# EAGLE design IRIS_Arduino_Shield_2 (EAGLE 9.5.0)
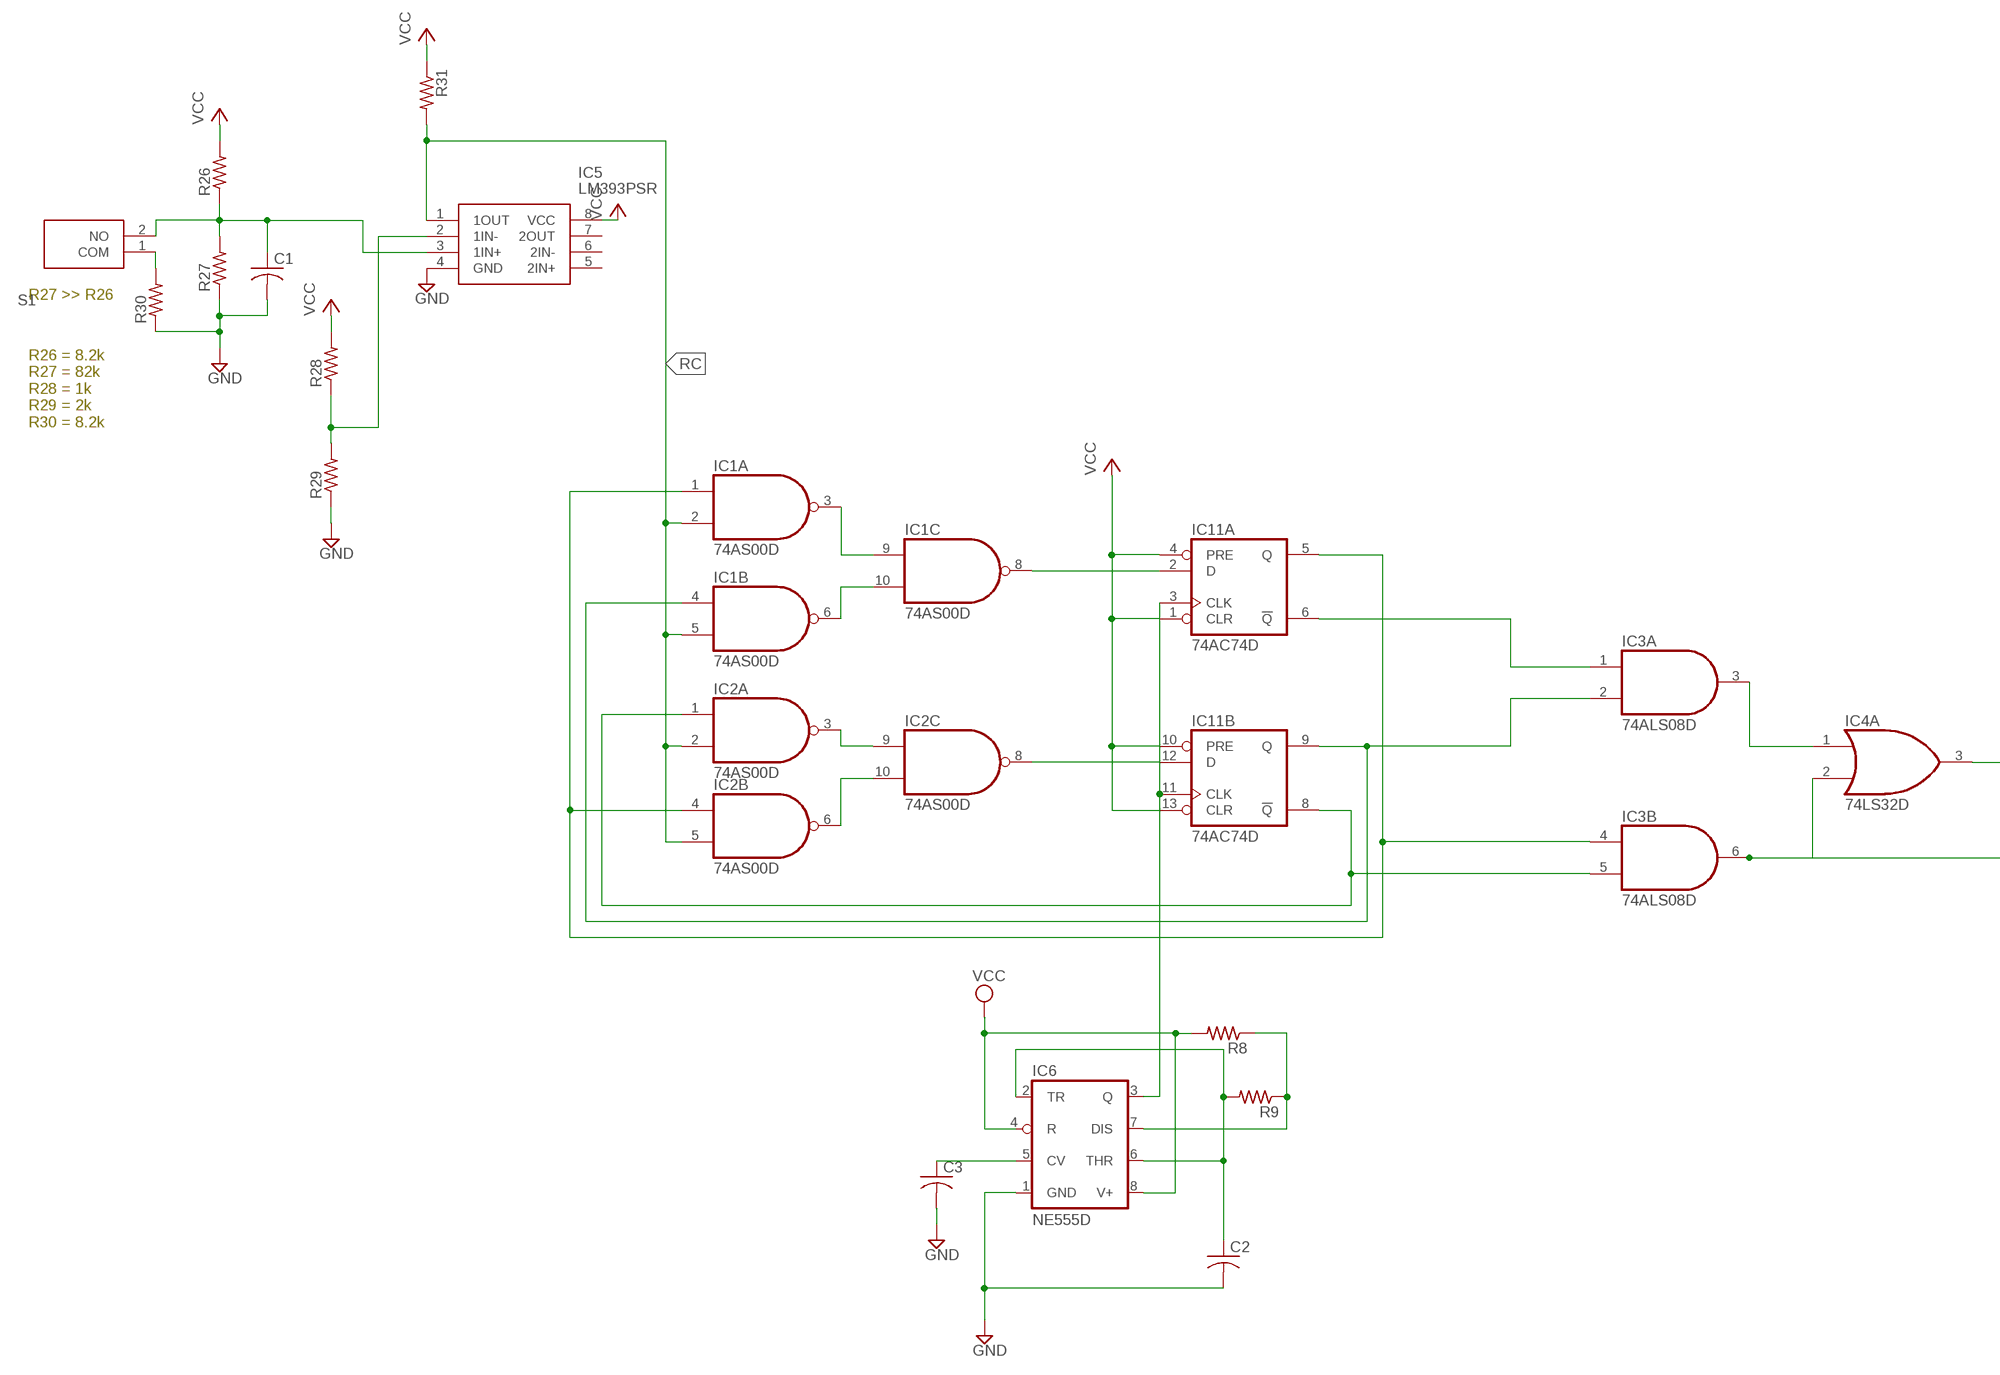
[diagram p0: schematic, sheet 1, part 1 of 2]
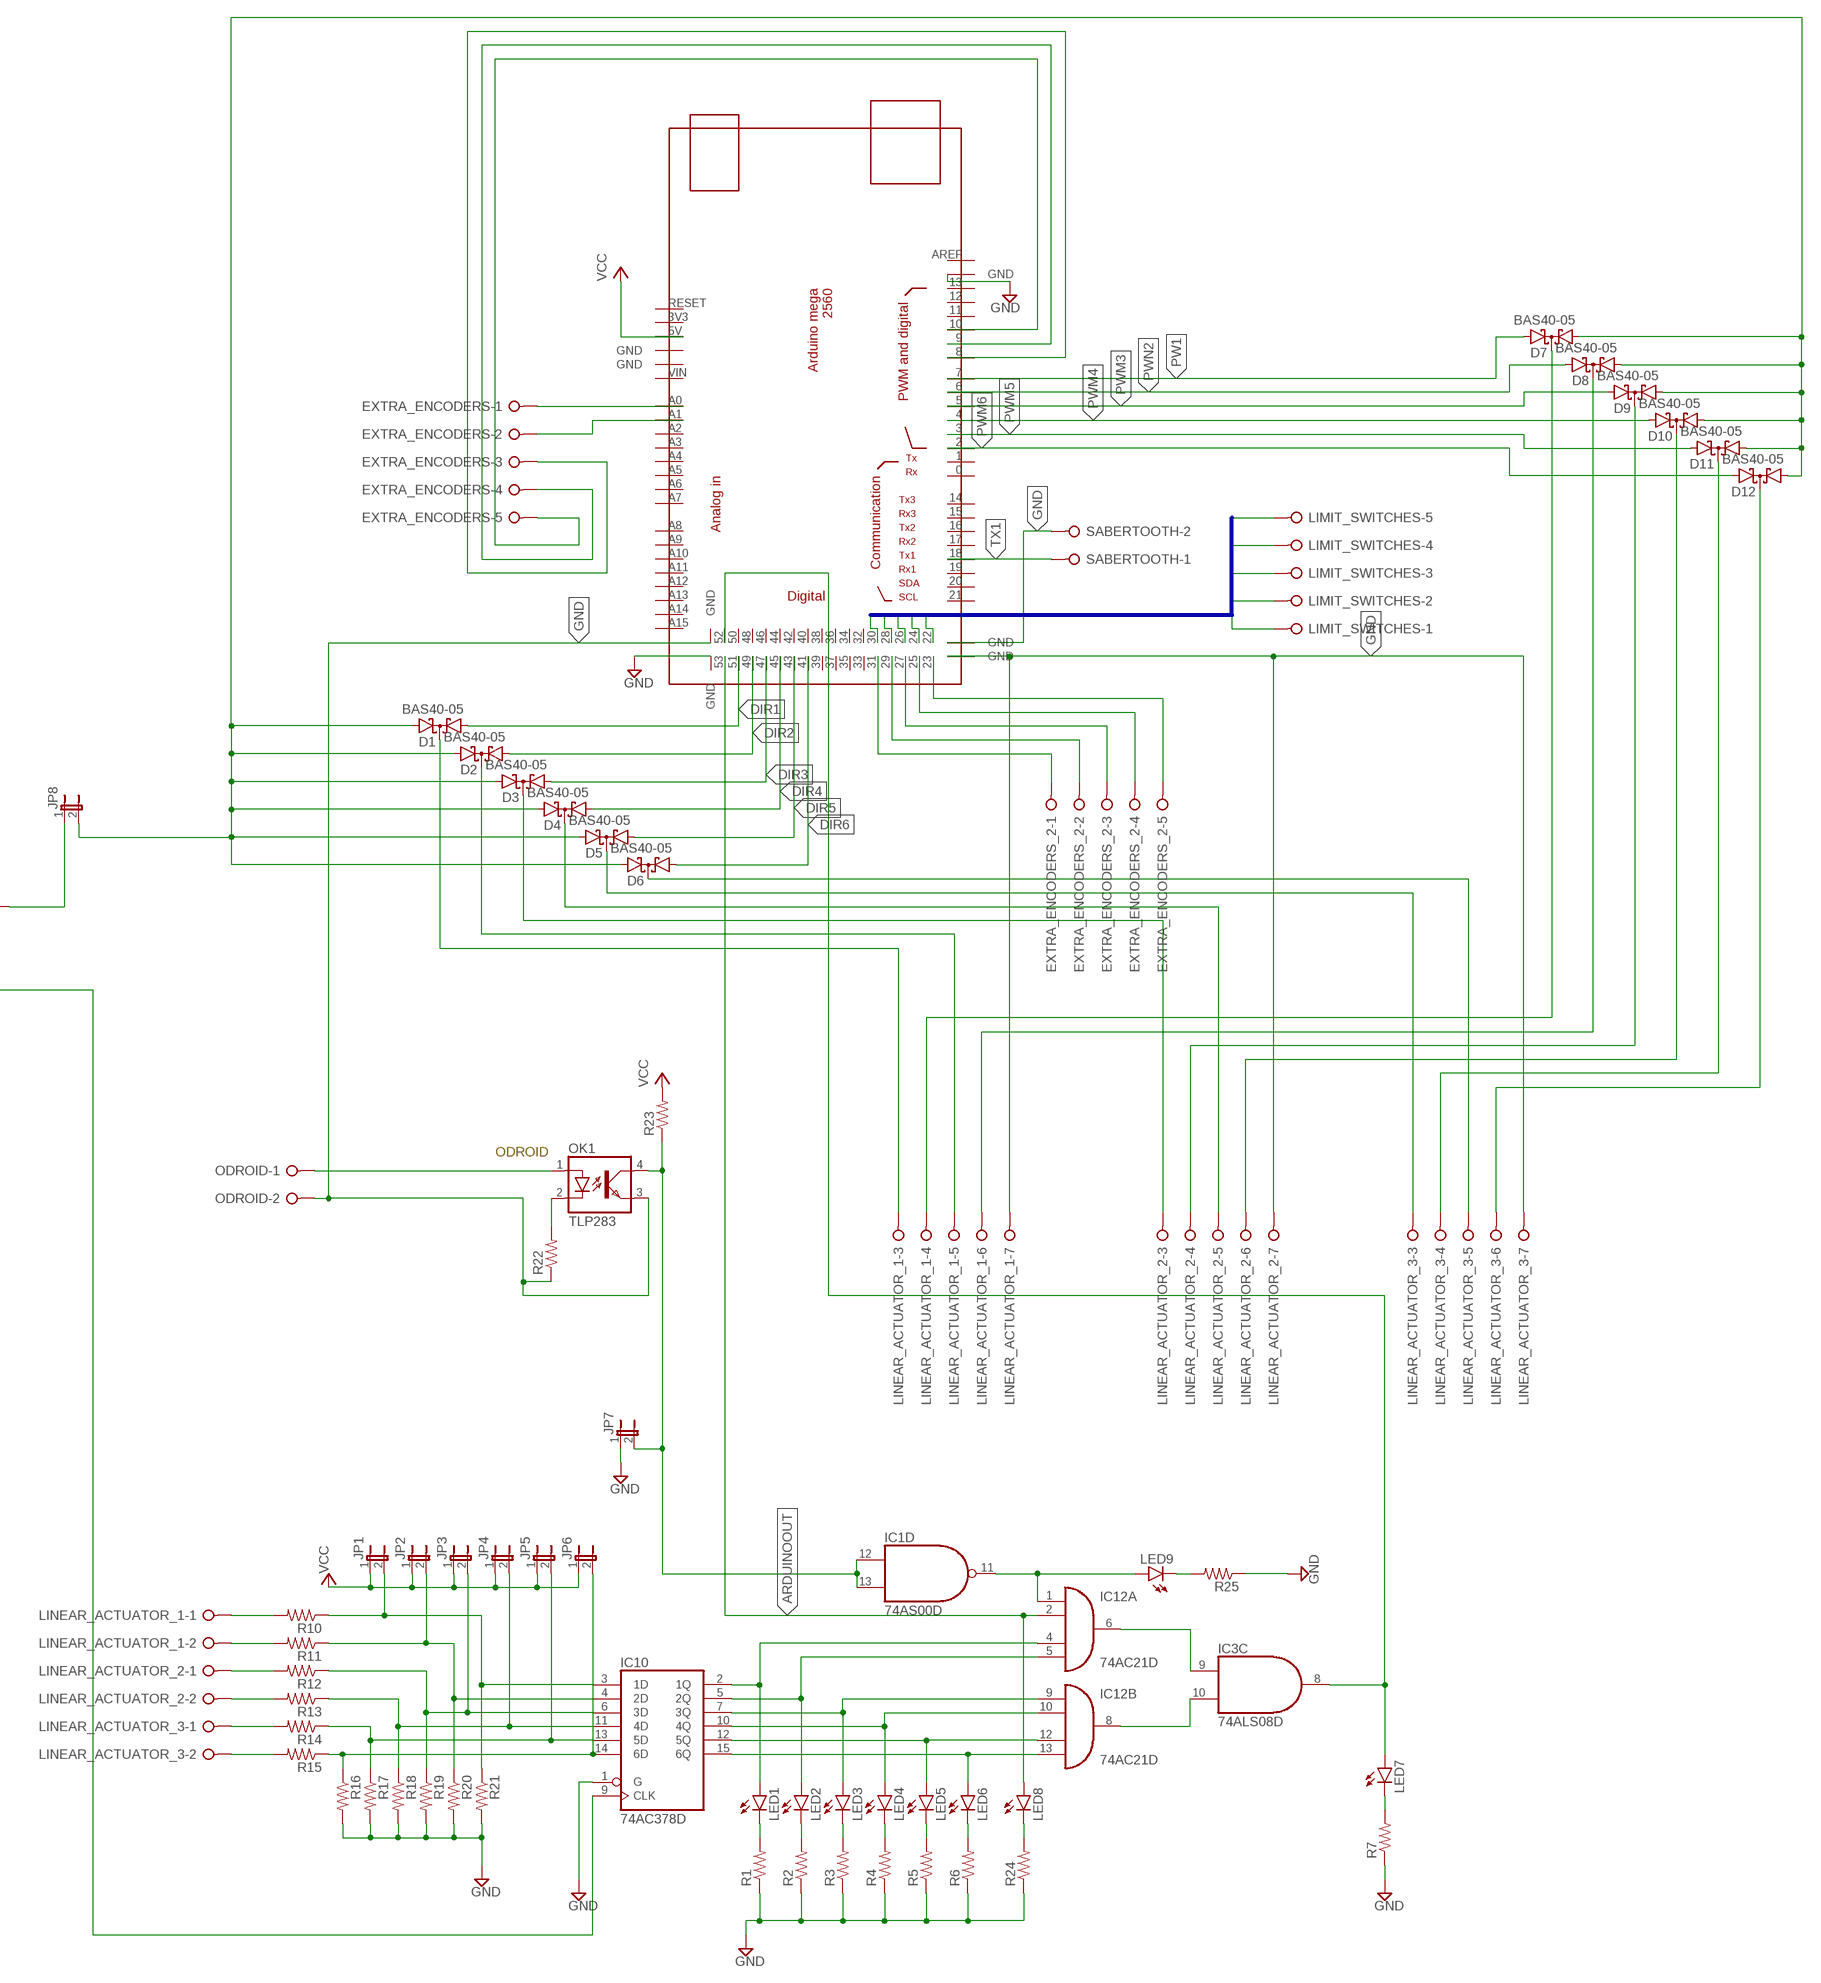
[diagram p1: schematic, sheet 1, part 2 of 2]

## Parts
C1  C-USC0805  [C0805]
C2  C-USC0805  [C0805]
C3  C-USC0805  [C0805]
D1  BAS40-05  [SOT23]
D2  BAS40-05  [SOT23]
D3  BAS40-05  [SOT23]
D4  BAS40-05  [SOT23]
D5  BAS40-05  [SOT23]
D6  BAS40-05  [SOT23]
D7  BAS40-05  [SOT23]
D8  BAS40-05  [SOT23]
D9  BAS40-05  [SOT23]
D10  BAS40-05  [SOT23]
D11  BAS40-05  [SOT23]
D12  BAS40-05  [SOT23]
EXTRA_ENCODERS  W237-05P  [W237-5P]
EXTRA_ENCODERS_2  W237-05P  [W237-5P]
IC1  74AS00D  [SO14]
IC2  74AS00D  [SO14]
IC3  74ALS08D  [SO14]
IC4  74LS32D  [SO14]
IC5  LM393PSR  [SOIC127P780X200-8N]
IC6  NE555D  [SO08]
IC10  74AC378D  [SO16]
IC11  74AC74D  [SO14]
IC12  74AC21D  [SO14]
JP1  JP1E  [JP1]
JP2  JP1E  [JP1]
JP3  JP1E  [JP1]
JP4  JP1E  [JP1]
JP5  JP1E  [JP1]
JP6  JP1E  [JP1]
JP7  JP1E  [JP1]
JP8  JP1E  [JP1]
LED1  LEDCHIPLED_1206  [CHIPLED_1206]
LED2  LEDCHIPLED_1206  [CHIPLED_1206]
LED3  LEDCHIPLED_1206  [CHIPLED_1206]
LED4  LEDCHIPLED_1206  [CHIPLED_1206]
LED5  LEDCHIPLED_1206  [CHIPLED_1206]
LED6  LEDCHIPLED_1206  [CHIPLED_1206]
LED7  LEDCHIPLED_1206  [CHIPLED_1206]
LED8  LEDCHIPLED_1206  [CHIPLED_1206]
LED9  LEDCHIPLED_1206  [CHIPLED_1206]
LIMIT_SWITCHES  W237-05P  [W237-5P]
LINEAR_ACTUATOR_1  W237-07P  [W237-7P]
LINEAR_ACTUATOR_2  W237-07P  [W237-7P]
LINEAR_ACTUATOR_3  W237-07P  [W237-7P]
ODROID  W237-02P  [W237-132]
OK1  TLP283  [MINI-FLAT-4]
R1  R-US_R0805  [R0805]
R2  R-US_R0805  [R0805]
R3  R-US_R0805  [R0805]
R4  R-US_R0805  [R0805]
R5  R-US_R0805  [R0805]
R6  R-US_R0805  [R0805]
R7  R-US_R0805  [R0805]
R8  R-US_R0805  [R0805]
R9  R-US_R0805  [R0805]
R10  R-US_R0805  [R0805]
R11  R-US_R0805  [R0805]
R12  R-US_R0805  [R0805]
R13  R-US_R0805  [R0805]
R14  R-US_R0805  [R0805]
R15  R-US_R0805  [R0805]
R16  R-US_R0805  [R0805]
R17  R-US_R0805  [R0805]
R18  R-US_R0805  [R0805]
R19  R-US_R0805  [R0805]
R20  R-US_R0805  [R0805]
R21  R-US_R0805  [R0805]
R22  R-US_R0805  [R0805]
R23  R-US_R0805  [R0805]
R24  R-US_R0805  [R0805]
R25  R-US_R0805  [R0805]
R26  R-US_R0805  [R0805]
R27  R-US_R0805  [R0805]
R28  R-US_R0805  [R0805]
R29  R-US_R0805  [R0805]
R30  R-US_R0805  [R0805]
R31  R-US_R0805  [R0805]
S1  PTS636_SL43_SMTR_LFS  [PTS636SL43SMTRLFS]
SABERTOOTH  W237-02P  [W237-132]
U$1  MEGA_DEVICE  [MEGAOUTLINE]

## Nets
ARDUINOOUT: IC12.2(A:I1) LED8.A U$1.53
DIR1: D1.1(A1) U$1.51
DIR2: D2.1(A1) U$1.49
DIR3: D3.1(A1) U$1.47
DIR4: D4.1(A1) U$1.45
DIR5: D5.1(A1) U$1.43
DIR6: D6.1(A1) U$1.41
GND: C1.2 C2.2 C3.2 IC5.4(GND) IC6.1(GND) IC10.1(G) JP7.1 LINEAR_ACTUATOR_1.7 LINEAR_ACTUATOR_2.7 LINEAR_ACTUATOR_3.7 ODROID.2 OK1.3(EMIT) R1.1 R2.1 R3.1 R4.1 R5.1 R6.1 R7.1 R16.2 R17.2 R18.2 R19.2 R20.2 R21.2 R22.1 R24.1 R25.1 R27.1 R29.1 R30.1 SABERTOOTH.2 U$1.GND@1(GND) U$1.GND@4(GND) U$1.GND@5(GND) U$1.GND@6(GND) U$1.GND@7(GND)
LA_TEST: D1.2(A2) D2.2(A2) D3.2(A2) D4.2(A2) D5.2(A2) D6.2(A2) D7.1(A1) D8.1(A1) D9.1(A1) D10.1(A1) D11.1(A1) D12.1(A1) JP8.2
N$1: IC1.3(A:O) IC1.9(C:I0)
N$2: IC1.6(B:O) IC1.10(C:I1)
N$3: IC1.8(C:O) IC11.2(A:D)
N$4: D7.3(C) LINEAR_ACTUATOR_1.4
N$5: IC6.3(Q) IC11.3(A:CLK) IC11.11(B:CLK)
N$6: IC2.8(C:O) IC11.12(B:D)
N$7: LED1.C R1.2
N$8: LED2.C R2.2
N$9: LED3.C R3.2
N$10: LED4.C R4.2
N$11: LED5.C R5.2
N$12: LED6.C R6.2
N$13: IC10.2(1Q) IC12.4(A:I2) LED1.A
N$14: IC10.5(2Q) IC12.5(A:I3) LED2.A
N$15: IC10.7(3Q) IC12.9(B:I0) LED3.A
N$16: IC10.10(4Q) IC12.10(B:I1) LED4.A
N$17: IC10.12(5Q) IC12.12(B:I2) LED5.A
N$18: IC10.15(6Q) IC12.13(B:I3) LED6.A
N$19: IC3.9(C:I0) IC12.6(A:O)
N$20: IC3.10(C:I1) IC12.8(B:O)
N$21: IC3.8(C:O) LED7.A U$1.52
N$22: LED7.C R7.2
N$23: IC2.3(A:O) IC2.9(C:I0)
N$24: IC2.6(B:O) IC2.10(C:I1)
N$25: IC4.3(A:O) JP8.1
N$26: C1.1 IC5.3(1IN+) R26.1 R27.2 S1.2(NO)
N$27: IC5.2(1IN-) R28.1 R29.2
N$28: C2.1 IC6.2(TR) IC6.6(THR) R9.2
N$29: D1.3(C) LINEAR_ACTUATOR_1.3
N$30: IC6.7(DIS) R8.1 R9.1
N$31: IC3.1(A:I0) IC11.6(A:!Q)
N$32: IC10.3(1D) JP1.2 R10.1 R21.1
N$33: ODROID.1 OK1.1(A)
N$34: IC10.4(2D) JP2.2 R11.1 R20.1
N$35: IC10.6(3D) JP3.2 R12.1 R19.1
N$36: IC10.11(4D) JP4.2 R13.1 R18.1
N$37: IC10.13(5D) JP5.2 R14.1 R17.1
N$38: IC10.14(6D) JP6.2 R15.1 R16.1
N$39: D8.3(C) LINEAR_ACTUATOR_1.6
N$40: D9.3(C) LINEAR_ACTUATOR_2.4
N$41: IC2.1(A:I0) IC3.5(B:I1) IC11.8(B:!Q)
N$42: IC1.1(A:I0) IC2.4(B:I0) IC3.4(B:I0) IC11.5(A:Q)
N$43: IC1.4(B:I0) IC3.2(A:I1) IC11.9(B:Q)
N$44: D10.3(C) LINEAR_ACTUATOR_2.6
N$45: D11.3(C) LINEAR_ACTUATOR_3.4
N$46: LED8.C R24.2
N$47: OK1.2(C) R22.2
N$48: LED9.C R25.2
N$49: IC1.12(D:I0) IC1.13(D:I1) JP7.2 OK1.4(COL) R23.1
N$50: EXTRA_ENCODERS.1 U$1.A0
N$51: IC1.11(D:O) IC12.1(A:I0) LED9.A
N$52: EXTRA_ENCODERS.2 U$1.A1
N$53: EXTRA_ENCODERS.4 U$1.9
N$54: R30.2 S1.1(COM)
N$55: D2.3(C) LINEAR_ACTUATOR_1.5
N$56: EXTRA_ENCODERS.3 U$1.8
N$57: D3.3(C) LINEAR_ACTUATOR_2.3
N$58: D4.3(C) LINEAR_ACTUATOR_2.5
N$59: D5.3(C) LINEAR_ACTUATOR_3.3
N$60: D6.3(C) LINEAR_ACTUATOR_3.5
N$61: D12.3(C) LINEAR_ACTUATOR_3.6
N$62: IC3.6(B:O) IC4.2(A:I1) IC10.9(CLK)
N$63: LINEAR_ACTUATOR_1.1 R10.2
N$64: LINEAR_ACTUATOR_1.2 R11.2
N$65: LINEAR_ACTUATOR_2.1 R12.2
N$66: LINEAR_ACTUATOR_2.2 R13.2
N$67: LINEAR_ACTUATOR_3.1 R14.2
N$68: LINEAR_ACTUATOR_3.2 R15.2
N$69: C3.1 IC6.5(CV)
N$70: EXTRA_ENCODERS.5 U$1.10
N$71: IC3.3(A:O) IC4.1(A:I0)
N$72: EXTRA_ENCODERS_2.5 U$1.23
N$73: EXTRA_ENCODERS_2.4 U$1.25
N$74: EXTRA_ENCODERS_2.3 U$1.27
N$75: EXTRA_ENCODERS_2.2 U$1.29
N$76: EXTRA_ENCODERS_2.1 U$1.31
N$77: LIMIT_SWITCHES.1 U$1.30
N$78: LIMIT_SWITCHES.2 U$1.28
N$79: LIMIT_SWITCHES.3 U$1.26
N$80: LIMIT_SWITCHES.4 U$1.24
N$81: LIMIT_SWITCHES.5 U$1.22
PW1: D7.2(A2) U$1.7
PWM3: D9.2(A2) U$1.5
PWM4: D10.2(A2) U$1.4
PWM5: D11.2(A2) U$1.3
PWM6: D12.2(A2) U$1.2
PWN2: D8.2(A2) U$1.6
RC: IC1.2(A:I1) IC1.5(B:I1) IC2.2(A:I1) IC2.5(B:I1) IC5.1(1OUT) R31.2
TX1: SABERTOOTH.1 U$1.18
VCC: IC5.8(VCC) IC6.4(R) IC6.8(V+) IC11.1(A:CLR) IC11.4(A:PRE) IC11.10(B:PRE) IC11.13(B:CLR) JP1.1 JP2.1 JP3.1 JP4.1 JP5.1 JP6.1 R8.2 R23.2 R26.2 R28.2 R31.1 U$1.5V
Unconnected: IC2.11(D:O) IC2.12(D:I0) IC2.13(D:I1) IC3.11(D:O) IC3.12(D:I0) IC3.13(D:I1) IC4.4(B:I0) IC4.5(B:I1) IC4.6(B:O) IC4.8(C:O) IC4.9(C:I0) IC4.10(C:I1) IC4.11(D:O) IC4.12(D:I0) IC4.13(D:I1) IC5.5(2IN+) IC5.6(2IN-) IC5.7(2OUT) U$1.0 U$1.1 U$1.3V3 U$1.11 U$1.12 U$1.13 U$1.14 U$1.15 U$1.16 U$1.17 U$1.19 U$1.20 U$1.21 U$1.32 U$1.33 U$1.34 U$1.35 U$1.36 U$1.37 U$1.38 U$1.39 U$1.40 U$1.42 U$1.44 U$1.46 U$1.48 U$1.50 U$1.A2 U$1.A3 U$1.A4 U$1.A5 U$1.A6 U$1.A7 U$1.A8 U$1.A9 U$1.A10 U$1.A11 U$1.A12 U$1.A13 U$1.A14 U$1.A15 U$1.AREF U$1.GND@2(GND) U$1.GND@3(GND) U$1.RESET U$1.VIN

## Buses
N$77,N$78,N$79,N$80,N$81

## Notes on the sheet
- R27 >> R26
- R26 = 8.2k
  R27 = 82k
  R28 = 1k
  R29 = 2k
  R30 = 8.2k
- ODROID

## Power pins joined to a net without a drawn wire
GND: IC1.7(P:GND) IC2.7(P:GND) IC3.7(P:GND) IC4.7(P:GND) IC10.8(GND) IC11.7(P:GND) IC12.7(P:GND)
VCC: IC1.14(P:VCC) IC2.14(P:VCC) IC3.14(P:VCC) IC4.14(P:VCC) IC10.16(VCC) IC11.14(P:VCC) IC12.14(P:VCC)

## Library data of the parts
C1-C3 = rcl:C-US: CAPACITOR, American symbol; SPICEPREFIX: C
D1-D12 = diode:BAS40-05: Silicon Schottky Diodes General-purpose diode for high-speed switching
EXTRA_ENCODERS EXTRA_ENCODERS_2 LIMIT_SWITCHES = con-wago-508:W237-05P: WAGO SREW CLAMP; OC_FARNELL: unknown; OC_NEWARK: unknown
IC1 IC2 = 74xx-us:74*00: Quad 2-input NAND gate
IC3 = 74xx-us:74*08: Quad 2-input AND gate
IC4 = 74xx-us:74*32: Quad 2-input OR gate
IC5 = SamacSys_Parts:LM393PSR: Dual differential comparator, commercial grade Source: Datasheet <http://www.ti.com/lit/gpn/lm393>; DESCRIPTION: Dual differential comparator, commercial grade; HEIGHT: 2mm; MANUFACTURER_NAME: Texas Instruments; MANUFACTURER_PART_NUMBER: LM393PSR; MOUSER_PART_NUMBER: 595-LM393PSR; MOUSER_PRICE-STOCK: https://www.mouser.com/Search/Refine.aspx?Keyword=595-LM393PSR
IC6 = linear:*555: TIMER
IC10 = 74xx-eu:74*378: Hex D type FLIP FLOP, enable
IC11 = 74xx-eu:74*74: Dual D type positive edge triggered FLIP FLOP, preset and clear
IC12 = 74xx-eu:74*21: Dual 4-input AND gate
JP1-JP8 = jumper:JP1E: JUMPER
LED1-LED9 = led:LED: LED OSRAM: - CHIPLED LG R971, LG N971, LY N971, LG Q971, LY Q971, LO R971, LY R971 LH N974, LH R974 LS Q976, LO Q976, LY Q976 LO Q996 - Hyper CHIPLED LW Q18S LB Q993, LB Q99A, LB R99A - SideLED LS A670, LO A670, LY A670, LG A670, LP A670 LB A673, LV A673, LT A673, LW A673 LH A674 LY A675 LS A676, LA A676, LO A676, LY A676, LW A676 LS A679, LY A679, LG A679 - Hyper Micro SIDELED® LS Y876, LA Y876, LO Y876, LY Y876 LT Y87S - SmartLED LW L88C, LW L88S LB L89C, LB L89S, LG L890 LS L89K, LO L89K, LY L89K LS L896, LA L896, LO L896, LY L896 - TOPLED LS T670, LO T670, LY T670, LG T670, LP T670 LSG T670, LSP T670, LSY T670, LOP T670, LYG T670 LG T671, LOG T671, LSG T671 LB T673, LV T673, LT T673, LW T673 LH T674 LS T676, LA T676, LO T676, LY T676, LB T676, LH T676, LSB T676, LW T676 LB T67C, LV T67C, LT T67C, LS T67K, LO T67K, LY T67K, LW E67C LS E67B, LA E67B, LO E67B, LY E67B, LB E67C, LV E67C, LT E67C LW T67C LS T679, LY T679, LG T679 LS T770, LO T770, LY T770, LG T770, LP T770 LB T773, LV T773, LT T773, LW T773 LH T774 LS E675, LA E675, LY E675, LS T675 LS T776, LA T776, LO T776, LY T776, LB T776 LHGB T686 LT T68C, LB T68C - Hyper Mini TOPLED® LB M676 - Mini TOPLED Santana® LG M470 LS M47K, LO M47K, LY M47K Source: http://www.osram.convergy.de LUXEON: - LUMILED® LXK2-PW12-R00, LXK2-PW12-S00, LXK2-PW14-U00, LXK2-PW14-V00 LXK2-PM12-R00, LXK2-PM12-S00, LXK2-PM14-U00 LXK2-PE12-Q00, LXK2-PE12-R00, LXK2-PE12-S00, LXK2-PE14-T00, LXK2-PE14-U00 LXK2-PB12-K00, LXK2-PB12-L00, LXK2-PB12-M00, LXK2-PB14-N00, LXK2-PB14-P00, LXK2-PB14-Q00 LXK2-PR12-L00, LXK2-PR12-M00, LXK2-PR14-Q00, LXK2-PR14-R00 LXK2-PD12-Q00, LXK2-PD12-R00, LXK2-PD12-S00 LXK2-PH12-R00, LXK2-PH12-S00 LXK2-PL12-P00, LXK2-PL12-Q00, LXK2-PL12-R00 Source: www.luxeon.com KINGBRIGHT: KA-3528ASYC Source: www.kingbright.com
LINEAR_ACTUATOR_1-LINEAR_ACTUATOR_3 = con-wago-508:W237-07P: WAGO SREW CLAMP; OC_FARNELL: unknown; OC_NEWARK: unknown
ODROID SABERTOOTH = con-wago-508:W237-02P: WAGO SREW CLAMP; OC_FARNELL: unknown; OC_NEWARK: unknown
OK1 = optocoupler:TLP283: TOSHIBA PHOTOCOUPLER GaAs IRED & PHOTO-TRANSISTOR Source: http://www.semicon.toshiba.co.jp/td/en/Opto/Photocoupler/en_20050928_TLP283_datasheet.pdf; OC_FARNELL: unknown; OC_NEWARK: unknown
R1-R31 = rcl:R-US_: RESISTOR, American symbol; SPICEPREFIX: R
S1 = SamacSys_Parts:PTS636_SL43_SMTR_LFS: Tactile Switches Tact 50mA 12VDC, 6.0x3.5, 4.3mm H, 130gf, G leads, No ground pin, Black Actuator Source: Datasheet <https://www.mouser.com/datasheet/2/60/pts636-1550567.pdf>; DESCRIPTION: Tactile Switches Tact 50mA 12VDC, 6.0x3.5, 4.3mm H, 130gf, G leads, No ground pin, Black Actuator; HEIGHT: 4.5mm; MANUFACTURER_NAME: C & K COMPONENTS; MANUFACTURER_PART_NUMBER: PTS636 SL43 SMTR LFS; MOUSER_PART_NUMBER: 611-PTS636SL43SMTRLF; MOUSER_PRICE-STOCK: https://www.mouser.com/Search/Refine.aspx?Keyword=611-PTS636SL43SMTRLF
U$1 = ArduinoMegaOutline:MEGA_DEVICE: mega card as device

## Board
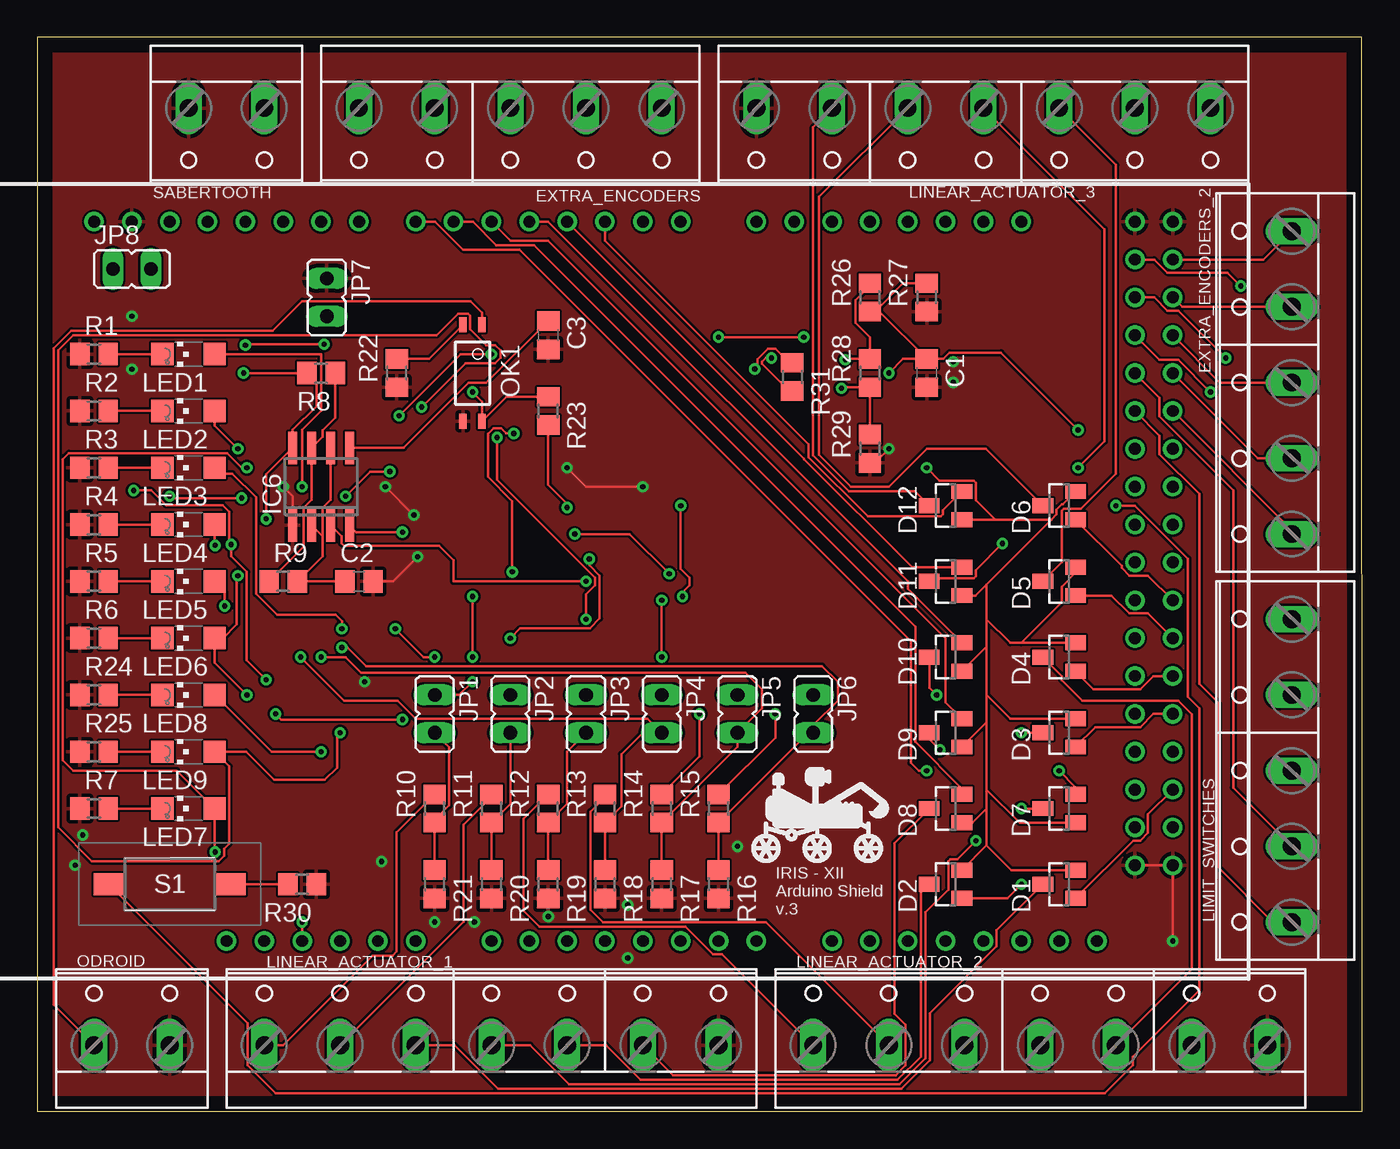
[diagram p2: board, top side]
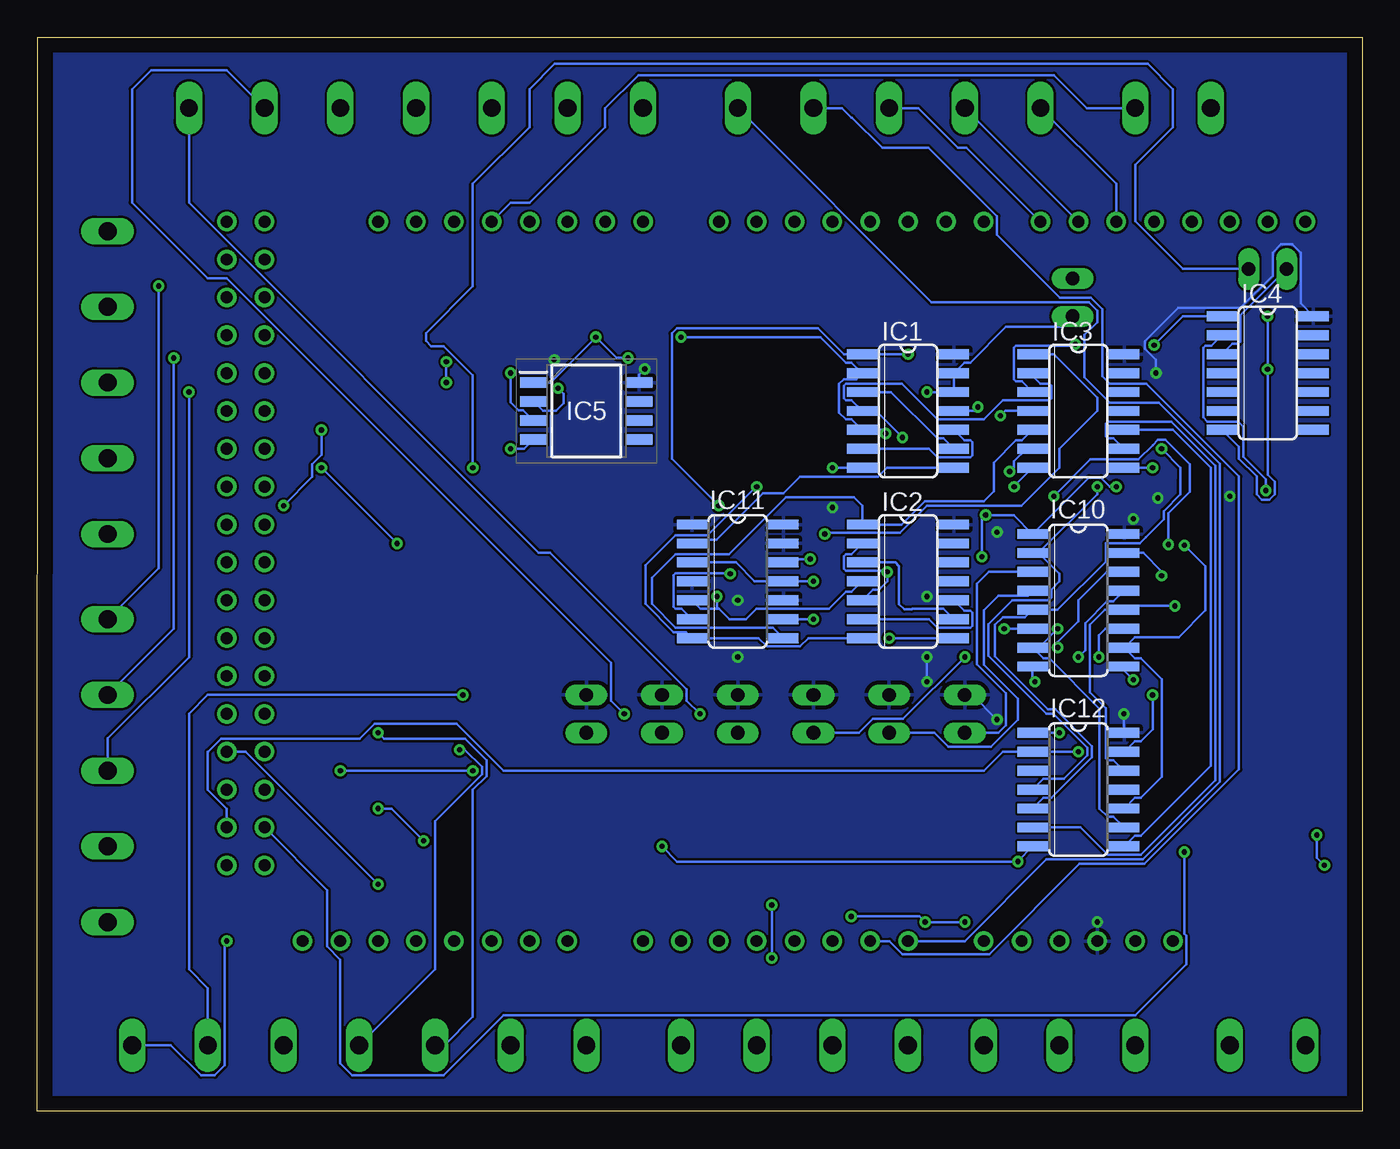
[diagram p3: board, bottom side, seen from below]

Size 88.92 x 72.06 mm. Coordinates in mm from the lower left corner, seen from the top.
Outline: 0,0 88.92,0 88.88,72.06 0,72.06 0,0
Copper layers (1*16): Top 0.035mm / dielectric 1.5mm / Bottom 0.035mm
Design rules "default": minimum track width 6mil, minimum drill 0.35mm, track to track 6mil, track to pad 6mil, pad to pad 6mil, via to via 6mil, smd to smd 6mil, copper to edge 40mil, drill to drill 6mil, minimum pad ring 10mil, minimum via ring 8mil, stop-mask expansion 4mil, vias tented up to drill 0mil, thermal gap 10mil

### Footprints (pad centres in the part's own frame; a part is rotated, then mirrored left to right if it is on the bottom)
C0805 = smd 1.3 x 1.5: 1 -0.95,0; 2 0.95,0
SOT23 = smd 1 x 1.4: 1 -0.95,-1.1; 2 0.95,-1.1; 3 0,1.1
W237-5P = drill 1.194 long: 1 -10.16,-0.635; 2 -5.08,-0.635; 3 0,-0.635; 4 5.08,-0.635; 5 10.16,-0.635
SO14 = smd 0.66 x 2.032: 1 -3.81,-3.073; 2 -2.54,-3.073; 3 -1.27,-3.073; 4 0,-3.073; 5 1.27,-3.073; 6 2.54,-3.073; 7 3.81,-3.073; 8 3.81,3.073; 9 2.54,3.073; 10 1.27,3.073; 11 0,3.073; 12 -1.27,3.073; 13 -2.54,3.073; 14 -3.81,3.073
SOIC127P780X200-8N = smd 1.8 x 0.7: 1 -3.55,1.905; 2 -3.55,0.635; 3 -3.55,-0.635; 4 -3.55,-1.905; 5 3.55,-1.905; 6 3.55,-0.635; 7 3.55,0.635; 8 3.55,1.905
SO08 = smd 0.6 x 2.2: 1 -1.905,-2.6; 2 -0.635,-2.6; 3 0.635,-2.6; 4 1.905,-2.6; 5 1.905,2.6; 6 0.635,2.6; 7 -0.635,2.6; 8 -1.905,2.6
SO16 = smd 0.66 x 2.032: 1 -4.445,-3.073; 2 -3.175,-3.073; 3 -1.905,-3.073; 4 -0.635,-3.073; 5 0.635,-3.073; 6 1.905,-3.073; 7 3.175,-3.073; 8 4.445,-3.073; 9 4.445,3.073; 10 3.175,3.073; 11 1.905,3.073; 12 0.635,3.073; 13 -0.635,3.073; 14 -1.905,3.073; 15 -3.175,3.073; 16 -4.445,3.073
JP1 = drill 0.914 long: 1 0,-1.27; 2 0,1.27
CHIPLED_1206 = smd 1.5 x 1.5: A 0,-1.75; C 0,1.75
W237-7P = drill 1.194 long: 1 -15.24,-0.635; 2 -10.16,-0.635; 3 -5.08,-0.635; 4 0,-0.635; 5 5.08,-0.635; 6 10.16,-0.635; 7 15.24,-0.635
W237-132 = drill 1.194 long: 1 -2.54,-0.635; 2 2.54,-0.635
MINI-FLAT-4 = smd 1 x 0.5: 1 -3.24,0.635; 2 -3.24,-0.635; 3 3.24,-0.635; 4 3.24,0.635
R0805 = smd 1.3 x 1.5: 1 -0.95,0; 2 0.95,0
PTS636SL43SMTRLFS = smd 2 x 1.5: 1 -4.1,0; 2 4.1,0
MEGAOUTLINE = drill 0.8: 0 12.7,24.13; 1 10.16,24.13; 2 7.62,24.13; 3 5.08,24.13; 3V3 -15.24,-24.13; 4 2.54,24.13; 5 0,24.13; 5V -12.7,-24.13; 6 -2.54,24.13; 7 -5.08,24.13; 8 -8.89,24.13; 9 -11.43,24.13; 10 -13.97,24.13; 11 -16.51,24.13; 12 -19.05,24.13; 13 -21.59,24.13; 14 17.78,24.13; 15 20.32,24.13; 16 22.86,24.13; 17 25.4,24.13; 18 27.94,24.13; 19 30.48,24.13; 20 33.02,24.13; 21 35.56,24.13; 22 43.18,21.59; 23 45.72,21.59; 24 43.18,19.05; 25 45.72,19.05; 26 43.18,16.51; 27 45.72,16.51; 28 43.18,13.97; 29 45.72,13.97; 30 43.18,11.43; 31 45.72,11.43; 32 43.18,8.89; 33 45.72,8.89; 34 43.18,6.35; 35 45.72,6.35; 36 43.18,3.81; 37 45.72,3.81; 38 43.18,1.27; 39 45.72,1.27; 40 43.18,-1.27; 41 45.72,-1.27; 42 43.18,-3.81; 43 45.72,-3.81; 44 43.18,-6.35; 45 45.72,-6.35; 46 43.18,-8.89; 47 45.72,-8.89; 48 43.18,-11.43; 49 45.72,-11.43; 50 43.18,-13.97; 51 45.72,-13.97; 52 43.18,-16.51; 53 45.72,-16.51; A0 0,-24.13; A1 2.54,-24.13; A2 5.08,-24.13; A3 7.62,-24.13; A4 10.16,-24.13; A5 12.7,-24.13; A6 15.24,-24.13; A7 17.78,-24.13; A8 22.86,-24.13; A9 25.4,-24.13; A10 27.94,-24.13; A11 30.48,-24.13; A12 33.02,-24.13; A13 35.56,-24.13; A14 38.1,-24.13; A15 40.64,-24.13; AREF -26.67,24.13; GND@1 -24.13,24.13; GND@2 -10.16,-24.13; GND@3 -7.62,-24.13; GND@4 43.18,24.13; GND@5 45.72,24.13; GND@6 43.18,-19.05; GND@7 45.72,-19.05; RESET -17.78,-24.13; VIN -5.08,-24.13

### Placement (x,y rotation side)
C1  59.69,49.53 270 top
C2  21.59,35.56 0 top
C3  34.29,52.07 270 top
D1  68.58,15.24 90 top
D2  60.96,15.24 90 top
D3  68.58,25.4 90 top
D4  68.58,30.48 90 top
D5  68.58,35.56 90 top
D6  68.58,40.64 90 top
D7  68.58,20.32 90 top
D8  60.96,20.32 90 top
D9  60.96,25.4 90 top
D10  60.96,30.48 90 top
D11  60.96,35.56 90 top
D12  60.96,40.64 90 top
EXTRA_ENCODERS  31.75,66.67 180 top
EXTRA_ENCODERS_2  83.57,48.89 90 top
IC1  30.48,46.99 270 bottom
IC2  30.48,35.56 270 bottom
IC3  19.05,46.99 270 bottom
IC4  6.35,49.53 270 bottom
IC5  52.07,46.99 0 bottom
IC6  19.05,41.91 0 top
IC10  19.05,34.29 270 bottom
IC11  41.91,35.56 270 bottom
IC12  19.05,21.59 270 bottom
JP1  26.67,26.67 180 top
JP2  31.75,26.67 180 top
JP3  36.83,26.67 180 top
JP4  41.91,26.67 180 top
JP5  46.99,26.67 180 top
JP6  52.07,26.67 180 top
JP7  19.43,54.61 180 top
JP8  6.35,56.52 270 top
LED1  10.16,50.8 90 top
LED2  10.16,46.99 90 top
LED3  10.16,43.18 90 top
LED4  10.16,39.37 90 top
LED5  10.16,35.56 90 top
LED6  10.16,31.75 90 top
LED7  10.16,20.32 90 top
LED8  10.16,27.94 90 top
LED9  10.16,24.13 90 top
LIMIT_SWITCHES  83.57,22.86 90 top
LINEAR_ACTUATOR_1  30.48,5.08 0 top
LINEAR_ACTUATOR_2  67.31,5.08 0 top
LINEAR_ACTUATOR_3  63.5,66.67 180 top
ODROID  6.35,5.08 0 top
OK1  29.21,49.53 270 top
R1  3.81,50.8 0 top
R2  3.81,46.99 0 top
R3  3.81,43.18 0 top
R4  3.81,39.37 0 top
R5  3.81,35.56 0 top
R6  3.81,31.75 0 top
R7  3.81,20.32 0 top
R8  19.05,49.53 180 top
R9  16.51,35.56 0 top
R10  26.67,20.32 90 top
R11  30.48,20.32 90 top
R12  34.29,20.32 90 top
R13  38.1,20.32 90 top
R14  41.91,20.32 90 top
R15  45.72,20.32 90 top
R16  45.72,15.24 270 top
R17  41.91,15.24 270 top
R18  38.1,15.24 270 top
R19  34.29,15.24 270 top
R20  30.48,15.24 270 top
R21  26.67,15.24 270 top
R22  24.13,49.53 90 top
R23  34.29,46.99 270 top
R24  3.81,27.94 0 top
R25  3.81,24.13 0 top
R26  55.88,54.61 90 top
R27  59.69,54.61 90 top
R28  55.88,49.53 90 top
R29  55.88,44.45 90 top
R30  17.78,15.24 180 top
R31  50.67,49.28 270 top
S1  8.89,15.24 180 top
SABERTOOTH  12.7,66.67 180 top
U$1  30.48,35.56 0 top

### Tracks (layer width: path | path; a pad name or v marks a point on that pad's centre or on a via)
ARDUINOOUT  (via drill 0.35)
  Top 0.152: v19.05,24.13 15.72,24.13 LED8.A
  Bottom 0.152: U$1.53 76.2,20.32 77.47,21.59 77.47,24.13 77.45,24.13 76.57,25.01 67.29,25.01 66.29,26.01 60.79,26.01 57.64,22.86 25.4,22.86 24.13,24.13 IC12.2 v19.05,24.13
DIR1
  Top 0.152: U$1.51 74.54,19.93 74.54,18.68 74.03,18.17 73.56,18.17 D1.1
DIR2  (via drill 0.35)
  Top 0.152: D2.1 65.09,14.29 v66.04,15.24
  Bottom 0.152: v66.04,15.24 74.93,24.13 U$1.49
DIR3
  Top 0.152: U$1.47 74.91,26.67 74.03,25.79 71.02,25.79 D3.1
DIR4
  Top 0.152: U$1.45 74.91,29.21 74.03,28.33 70.88,28.33 D4.1
DIR5
  Top 0.152: U$1.43 74.54,33.41 73.29,33.41 72.09,34.61 D5.1
DIR6
  Top 0.152: U$1.41 74.54,35.95 73.29,35.95 72.78,36.46 72.78,36.59 D6.1
GND  (via drill 0.35)
  Top 0.152: v40.64,41.91 36.83,41.91 v35.56,43.18 | v16.51,41.91 17.14,41.28 IC6.1 | v25.27,40 v23.37,41.91 | v25.53,37.21 23.88,35.56 C2.2 | U$1.GND@6 U$1.GND@7 v76.2,11.43 | R29.1 56.2,43.5 v57.15,44.45
  Bottom 0.152: IC3.7 23.37,41.94 v23.37,41.91 | IC1.7 v35.56,43.18 | IC2.7 37.17,31.75 37.73,31.19 39.95,31.19 40.51,31.75 IC11.7 45.39,32.16 46.22,32.16 48.11,34.04 48.11,36.64 46.09,38.66 43.93,38.66 40.68,41.91 v40.64,41.91 | IC10.8 22.12,28.98 v21.97,28.83 | v26.67,12.7 v29.34,12.7 29.72,13.08 v34.29,13.08 | v16.51,41.91 16.92,41.91 17.53,42.52 18.34,42.52 IC10.1 23.39,40 v25.27,40 25.53,39.75 v25.53,37.21 | v39.62,10.29 v39.62,13.84 | v76.2,11.43 76.35,11.28 76.35,3.08 77,2.43 77.94,2.43 79.95,4.45 LINEAR_ACTUATOR_2.7 | v3.05,18.54 3.05,17.02 v2.54,16.51 | v6.35,53.34 v6.35,49.78 6.35,42.72 5.87,42.24 5.87,41.41 6.23,41.05 6.73,41.05 7.08,41.41 7.08,42.59 8.28,43.79 8.28,44.58 IC4.7 | IC12.7 23.11,16.79 v23.11,16.76 45.97,16.76 v46.99,17.78 | v61.47,50.29 v61.47,48.89 | v57.15,44.45 56.25,44.45 IC5.4
  pour Top: -2.54,73.66 -2.54,-2.54 91.44,-2.54 91.44,73.66
LA_TEST  (via drill 0.35)
  Top 0.152: D6.2 68.81,40.72 68.76,40.72 68.41,40.37 68.41,40.05 68.05,39.69 | D12.1 64.29,39.69 | 64.29,39.69 68.05,39.69 | 68.05,39.69 63.71,35.35 | 63.71,35.35 62.97,34.61 D11.1 | 63.71,35.35 63.71,33.02 | 63.71,33.02 63.71,31.18 | 63.71,31.18 63.71,27.94 | 63.71,27.94 63.71,26.1 | 63.71,26.1 63.71,21.59 | 63.71,21.59 63.71,20.32 | 63.71,20.32 63.71,17.84 | 63.71,17.84 D2.2 | D1.2 65.36,16.19 63.71,17.84 | D7.1 65.93,19.37 63.71,21.59 | D8.1 62.76,19.37 63.71,20.32 | D9.1 63.71,26.1 | D3.2 65.3,26.35 63.71,27.94 | D10.1 63.71,31.18 | D4.2 66.04,31.43 | 66.04,31.43 65.3,31.43 63.71,33.02 | 66.04,31.43 68.75,34.14 68.75,35.2 69.68,36.13 D5.2 | v59.69,43.18 60.55,42.32 62.86,42.32 62.99,42.19 62.99,41 64.29,39.69
  Bottom 0.152: JP8.2 12.04,56.52 15.24,59.71 15.24,63.5 12.7,66.04 12.7,68.58 14.39,70.27 54.19,70.27 55.88,68.58 55.88,66.04 59.69,62.23 59.69,55.34 62.84,52.19 62.84,51.69 62.48,51.34 61.65,51.34 59.69,49.37 v59.69,43.18
N$1
  Bottom 0.152: IC1.9 28.12,45.16 28.52,45.16 31.62,48.26 IC1.3
N$2
  Bottom 0.152: IC1.6 29.08,44.45 28.52,43.89 26.3,43.89 26.16,44.03 26.16,44.88 26.3,45.01 26.7,45.01 IC1.10
N$3
  Bottom 0.152: IC11.2 44.73,38.35 43.34,38.35 40.21,41.48 38.83,41.48 37.73,42.57 32.49,42.57 31.88,43.18 IC1.8
N$4  (via drill 0.35)
  Top 0.152: LINEAR_ACTUATOR_1.4 33.08,4.45 35.7,1.82 57.87,1.82 59.61,3.55 59.61,13.36 61.13,14.89 61.13,16.79 61.27,16.92 61.75,16.92 v62.99,18.16 | D7.3 v66.04,20.32
  Bottom 0.152: v62.99,18.16 65.15,20.32 v66.04,20.32
N$5  (via drill 0.35)
  Top 0.152: IC6.3 20.43,38.57 20.43,38.11 20.61,37.94 26.97,37.94 27.94,36.96 27.94,35.56 v36.83,35.56
  Bottom 0.152: IC11.3 42.04,36.83 40.77,35.56 IC11.11 v36.83,35.56
N$6  (via drill 0.35)
  Top 0.152: v37.05,37.05 37.05,36.63 37.74,35.94 37.74,33.07 37.08,32.41 32.41,32.41 v31.75,31.75
  Bottom 0.152: IC2.8 v31.75,31.75 | v37.05,37.05 38.61,37.05 IC11.12
N$7
  Top 0.152: LED1.C R1.2
N$8
  Top 0.152: LED2.C R2.2
N$9
  Top 0.152: LED3.C R3.2
N$10
  Top 0.152: LED4.C R4.2
N$11
  Top 0.152: LED5.C R5.2
N$12
  Top 0.152: LED6.C R6.2
N$13  (via drill 0.35)
  Top 0.152: v17.78,41.91 17.78,45.72 19.05,46.99 19.05,50.8 LED1.A
  Bottom 0.152: v17.78,41.91 17.78,41.41 21.72,37.47 | 21.72,37.47 IC10.2 | IC12.4 21.41,22.3 20.02,22.3 18.44,23.88 18.44,24.38 20.73,26.67 21.21,26.67 25.09,30.56 25.09,32.69 23.49,34.29 21.09,34.29 20.88,34.5 20.88,35 20.32,35.56 20.32,36.06 21.72,37.47
N$14  (via drill 0.35)
  Top 0.152: v13.46,44.45 11.91,46 LED2.A
  Bottom 0.152: IC12.5 21.41,21.03 20.86,21.03 18.14,23.75 18.14,24.51 20.61,26.97 21.08,26.97 24.64,30.53 24.64,32.64 24.13,33.15 22.63,33.15 IC10.5 20.45,33.66 17.22,36.89 17.22,38.1 14.94,38.1 14.52,38.53 13.32,39.72 13.32,40.26 12.19,41.39 12.19,42.41 12.19,43.18 v13.46,44.45
N$15  (via drill 0.35)
  Top 0.152: LED3.A 12.3,42.78 13.09,42.78 14.68,41.2 14.68,34.72 16.09,33.31 20.03,33.31 20.45,32.89 v20.45,32.39
  Bottom 0.152: IC12.9 16.69,19.76 17.09,19.76 17.63,20.3 17.63,27.02 21.01,30.4 21.41,30.4 IC10.7 21.72,31.11 v20.45,32.39
N$16  (via drill 0.35)
  Top 0.152: LED4.A 11.91,38 v11.94,37.97
  Bottom 0.152: IC12.10 15.27,21.03 14.87,21.03 13.46,22.43 13.46,29 14.87,30.4 15.27,30.4 IC10.10 15.27,31.83 12.33,31.83 10.54,33.61 10.54,36.58 v11.94,37.97
N$17  (via drill 0.35)
  Top 0.152: LED5.A 12.57,34.9 v12.57,33.91
  Bottom 0.152: IC12.12 16.69,23.57 17.09,23.57 17.22,23.71 17.22,27.04 18.29,28.11 18.29,32.64 17.27,33.66 IC10.12 15.72,33.91 v12.57,33.91
N$18  (via drill 0.35)
  Top 0.152: v13.46,35.94 13.4,35.88 13.4,32.68 12.46,31.75 LED6.A 11.91,30.1 v14.07,27.94
  Bottom 0.152: v13.46,35.94 13.46,36.22 14.71,37.47 IC10.15 | IC12.13 15.27,24.84 14.87,24.84 14.07,25.64 v14.07,27.94
N$19
  Bottom 0.152: IC12.6 18.92,19.05 17.09,17.22 14.87,17.22 9.85,22.23 9.85,43.31 12.83,46.28 17.09,46.28 17.22,46.14 17.22,45.3 17.09,45.16 16.69,45.16 IC3.9
N$20
  Bottom 0.152: IC12.8 15.27,18.49 14.87,18.49 10.16,23.2 10.16,43.18 12.7,45.72 IC3.10
N$21  (via drill 0.35)
  Top 0.152: v11.94,17.4 11.91,17.43 LED7.A 9.37,22.86 2.41,22.86 1.7,23.57 1.7,43.75 2.11,44.16 12.75,44.16 13.73,43.18 v14.07,43.18
  Bottom 0.152: U$1.52 69.46,14.85 69.46,11.06 68.58,10.18 68.58,3.23 67.78,2.43 61.65,2.43 57.62,6.46 15.24,6.46 11.82,9.89 11.82,11.8 11.94,11.92 v11.94,17.4 | v14.07,43.18 IC3.8
N$22
  Top 0.152: LED7.C R7.2
N$23
  Bottom 0.152: IC2.9 28.12,33.73 30.18,33.73 30.23,33.68 30.73,33.68 31.09,34.04 31.09,36.58 31.34,36.83 IC2.3
N$24
  Bottom 0.152: IC2.6 29.08,33.02 28.52,32.46 26.3,32.46 26.16,32.59 26.16,33.44 26.3,33.58 26.7,33.58 IC2.10
N$25
  Bottom 0.152: JP8.1 8.18,53.42 8.18,51.64 8.31,51.51 8.71,51.51 IC4.3
N$26  (via drill 0.35)
  Top 0.152: C1.1 56.51,53.66 R26.1 56.2,53.66 58.1,55.56 R27.2 | S1.2 14.12,5.91 14.12,3.08 15.99,1.21 71.64,1.21 73.51,3.08 73.51,3.66 77.98,8.13 77.98,27.05 77.22,27.81 77.22,37.08 73.66,40.64 v72.39,40.64 | v57.15,49.53 58.1,50.48 C1.1 | C1.1 60.8,50.48 61.22,50.9 64.67,50.9 v69.85,45.72
  Bottom 0.152: v72.39,40.64 70.46,42.57 70.46,43.43 69.85,44.04 v69.85,45.72 | IC5.3 56.31,47.05 56.61,47.05 57.15,47.58 v57.15,49.53
N$27  (via drill 0.35)
  Top 0.152: R29.2 R28.1 54.04,48.58 v53.97,48.51
  Bottom 0.152: IC5.2 54.98,46.99 54.1,46.99 53.59,47.5 53.59,48.13 v53.97,48.51
N$28
  Top 0.152: C2.1 R9.2 19.16,37.26 19.16,38.57 | IC6.6 19.68,41.03 19.16,40.5 19.16,38.57 | IC6.2 19.16,38.57
N$29
  Top 0.152: D1.3 64.38,12.14 64.38,11.06 59.91,6.59 59.91,3.43 57.99,1.51 30.93,1.51 27.99,4.45 LINEAR_ACTUATOR_1.3
N$30
  Top 0.152: R8.1 20,46.55 19.16,45.7 19.16,45.25 IC6.7 18.41,41.03 17.89,40.5 17.89,37.89 R9.1
N$31  (via drill 0.35)
  Top 0.152: v42.42,36.07 39.75,38.73 v36.07,38.73
  Bottom 0.152: IC11.6 45.69,33.73 46.09,33.73 46.23,33.86 46.23,35.98 46.09,36.12 42.47,36.12 v42.42,36.07 | IC3.1 20.7,50.8 17.78,47.88 17.78,46.99 20.32,44.45 20.32,43.18 22.86,40.64 29.21,40.64 31.04,38.81 35.99,38.81 v36.07,38.73
N$32
  Top 0.152: R21.1 R10.1 26.67,19.55 27.65,20.53 27.65,24.42 JP1.2
  Bottom 0.152: IC10.3 25.06,36.19 25.86,35.4 25.86,30.01 23.9,28.05 23.9,25.92 24.43,25.4 JP1.2
N$33
  Top 0.152: ODROID.1 1.09,7.16 1.09,51.19 2.28,52.38 15.8,52.38 17.78,54.36 29.08,54.36 29.84,53.59 OK1.1
N$34
  Top 0.152: R20.1 R11.1 31.75,20.64 JP2.2
  Bottom 0.152: IC10.4 22.45,34.59 24.41,34.59 25.4,33.6 25.4,29.98 23.11,27.69 23.11,26.29 24.93,24.46 27.77,24.46 28.71,25.4 JP2.2
N$35  (via drill 0.35)
  Top 0.152: R19.1 R12.1 35.56,20.64 35.56,24.13 JP3.2 | v26.67,30.48 25.94,30.48 v24.03,32.39
  Bottom 0.152: v26.67,30.48 30.81,26.34 32.85,26.34 33.79,25.4 JP3.2 | v24.03,32.39 IC10.6
N$36  (via drill 0.35)
  Top 0.152: R18.1 R13.1 39.21,20.48 39.21,23.97 40.64,25.4 JP4.2 40.97,26.34 25.4,26.34 24.18,27.56 20.6,27.56 v17.68,30.48
  Bottom 0.152: IC10.11 17.25,32.39 17.68,31.95 v17.68,30.48
N$37  (via drill 0.35)
  Top 0.152: R17.1 R14.1 46.99,24.45 JP5.2 48.64,27.05 48.64,28.33 47.53,29.44 21.74,29.44 20.7,30.48 v19.05,30.48
  Bottom 0.152: v19.05,30.48 18.59,30.94 18.59,32.77 17.14,34.21 16.69,34.21 IC10.13
N$38  (via drill 0.35)
  Top 0.152: R16.1 R15.1 51.75,25.4 JP6.2 52.07,25.9 53.72,27.55 53.72,28.83 52.68,29.87 22.07,29.87 20.83,31.11 v20.45,31.11
  Bottom 0.152: v20.45,31.11 20.45,31.47 19.05,32.87 19.05,34.29 17.14,36.19 IC10.14
N$39
  Top 0.152: D8.3 57.54,18 57.54,6.54 58.27,5.81 58.27,3.08 57.62,2.43 42.66,2.43 LINEAR_ACTUATOR_1.6
N$40  (via drill 0.35)
  Top 0.152: D9.3 59.86,24.98 v60.58,24.26
  Bottom 0.152: v60.58,24.26 60.23,24.26 59.08,23.11 59.08,22.61 62.23,19.46 62.23,9.52 LINEAR_ACTUATOR_2.4
N$41
  Bottom 0.152: IC11.8 39.55,32.46 46.09,32.46 47.68,34.04 47.68,35.81 46.09,37.39 42.49,37.39 38.68,41.2 34.11,41.2 33.55,40.64 IC2.1 30.91,39.37 29.34,40.94 25.4,40.94 24.74,41.61 24.74,43.51 23.23,45.01 22.84,45.01 IC3.5
N$42  (via drill 0.35)
  Top 0.152: v43.18,40.64 43.18,36.42 43.79,35.81 43.79,35.31 43.31,34.83 v43.31,34.54 | v24.29,46.66 28.43,50.8 v30.48,50.8
  Bottom 0.152: IC2.4 34.27,34.85 34.66,34.85 35.78,33.73 40.64,33.73 41.35,33.02 42.47,33.02 43.18,33.73 | IC11.5 44.42,33.73 43.18,33.73 | v24.29,46.66 23.96,46.99 IC3.4 | v30.48,50.8 IC1.1 34.79,50.8 36.54,52.55 45.97,52.55 46.33,52.19 46.33,43.79 v43.18,40.64 | v43.31,34.54 43.31,33.86 43.18,33.73
N$43  (via drill 0.35)
  Top 0.152: v30.86,45.21 30.86,42.39 37.44,35.81 37.44,35.31 36.83,34.7 v36.83,33.02
  Bottom 0.152: IC11.9 v36.83,33.02 | v30.86,45.21 32.64,46.99 IC1.4 34.27,47.7 34.66,47.7 34.8,47.84 34.8,48.69 34.66,48.82 30.91,48.82 28.52,46.43 25.38,46.43 24.11,47.7 21.01,47.7 20.88,47.84 20.88,48.69 21.01,48.82 21.59,48.82 22.12,49.35 IC3.2
N$44  (via drill 0.35)
  Top 0.152: D10.3 59.86,28.43 v60.35,27.94
  Bottom 0.152: v60.35,27.94 77.47,27.94 78.74,26.67 78.74,9.52 77.47,8.25 LINEAR_ACTUATOR_2.6
N$45  (via drill 0.35)
  Top 0.152: LINEAR_ACTUATOR_3.4 71.63,59.18 71.63,44.96 v69.85,43.18 | D11.3 60.08,35.78 62.86,35.78 62.99,35.92 62.99,36.32 v64.77,38.1
  Bottom 0.152: v69.85,43.18 v64.77,38.1
N$46
  Top 0.152: LED8.C R24.2
N$47
  Top 0.152: OK1.2 26.28,50.48 R22.2
N$48
  Top 0.152: R25.2 LED9.C
N$49  (via drill 0.35)
  Top 0.152: R23.1 31.5,47.94 OK1.4 29.84,47.62 v29.21,48.26
  Bottom 0.152: JP7.2 20.14,52.63 23.91,52.63 26.3,50.24 26.7,50.24 IC1.13 IC1.12 v29.21,48.26
N$50
  Bottom 0.152: EXTRA_ENCODERS.1 41.91,67.29 28.9,54.28 18.33,54.28 17.78,53.73 17.78,52.95 18.64,52.09 18.64,49.26 16.93,47.55 13.67,47.55 9.55,43.43 9.55,22.11 14.74,16.92 21.18,16.92 26.67,11.43 U$1.A0
N$51  (via drill 0.35)
  Top 0.152: v20.32,25.4 20.11,25.19 20.11,23.07 19.3,22.25 15.9,22.25 14.02,24.13 LED9.A 12.89,23.15 12.89,17.97 12.54,17.62 12.54,17.15 12.19,16.79 3.66,16.79 1.4,19.05 1.4,51.06 2.41,52.07 26.8,52.07 28.23,53.5 28.92,53.5 29.05,53.37 29.05,52.49 30.13,51.41 30.73,51.41 31.09,51.05 31.09,50.55 30.73,50.19 28.73,50.19 v25.79,47.25
  Bottom 0.152: v20.32,25.4 IC12.1 | IC1.11 26.05,46.99 v25.79,47.25
N$52
  Bottom 0.152: U$1.A1 31.73,11.43 30.85,10.55 25.03,10.55 18.97,16.61 14.61,16.61 8.28,22.94 8.28,42.6 14.51,48.82 16.93,48.82 17.43,49.31 17.43,53.81 18.2,54.59 20.29,54.59 24.52,58.81 24.52,60.06 29.12,64.66 32.22,64.66 34.23,66.67 34.29,66.67 34.92,67.31 EXTRA_ENCODERS.2
N$53
  Bottom 0.152: EXTRA_ENCODERS.4 U$1.9
N$54
  Top 0.152: R30.2 S1.1
N$55
  Top 0.152: LINEAR_ACTUATOR_1.5 38.16,4.45 40.48,2.12 57.74,2.12 59.3,3.68 59.3,14.68 D2.3
N$56
  Bottom 0.152: U$1.8 26.56,64.66 27.14,64.66 29.79,67.31 EXTRA_ENCODERS.3
N$57  (via drill 0.35)
  Top 0.152: D3.3 v66.04,25.4
  Bottom 0.152: v66.04,25.4 65.63,24.99 60.2,24.99 58.78,23.57 58.78,22.48 59.69,21.57 59.69,6.35 61.59,4.45 LINEAR_ACTUATOR_2.3
N$58
  Top 0.152: D4.3 68.75,29.21 68.75,28.93 70.13,27.55 76.57,27.55 77.47,26.65 77.47,9.52 LINEAR_ACTUATOR_2.5
N$59
  Top 0.152: D5.3 68.75,36.83 68.75,40.28 68.88,40.42 70.03,40.42 72.39,42.78 72.39,63.5 LINEAR_ACTUATOR_3.3
N$60
  Top 0.152: D6.3 63.67,44.45 59.69,44.45 57.15,41.91 54.61,41.91 52.46,44.06 52.46,61.35 LINEAR_ACTUATOR_3.5
N$61
  Top 0.152: D12.3 58.89,41.61 54.48,41.61 52.07,44.02 52.07,66.04 LINEAR_ACTUATOR_3.6
N$62  (via drill 0.35)
  Top 0.152: v15.37,28.96 14.07,30.25 14.07,36.19 13.02,37.24 v13.02,38.04 12.89,38.17 12.89,40.22 12.43,40.67 8.64,40.67 7.65,41.66 v6.48,41.66 | v20.7,41.28 22.35,42.93 v23.67,42.93
  Bottom 0.152: IC10.9 15.98,29.57 v15.37,28.96 | v13.02,38.04 13.02,40.14 11.59,41.57 11.59,43.43 13.21,45.06 13.71,45.06 14.07,44.7 14.07,44.69 15.02,43.74 18.24,43.74 v20.7,41.28 | v23.67,42.93 23.37,43.23 23.37,43.61 22.52,44.45 IC3.6 | v6.48,41.66 6.48,42.42 7.98,43.92 7.98,45.94 8.31,46.28 10.38,46.28 10.67,46.56 10.67,51.23 10.53,51.36 10.13,51.36 IC4.2
N$63
  Top 0.152: R10.2 24.13,18.73 24.13,10.74 23.84,10.45 22.52,10.45 16.51,4.45 LINEAR_ACTUATOR_1.1
N$64
  Top 0.152: LINEAR_ACTUATOR_1.2 28.61,12.74 28.61,19.23 30.48,21.09 R11.2
N$65
  Top 0.152: LINEAR_ACTUATOR_2.1 45.97,10.55 45.35,10.55 43.51,12.39 33.7,12.39 32.64,13.46 32.64,19.62 R12.2
N$66
  Top 0.152: LINEAR_ACTUATOR_2.2 48.89,12.7 37.97,12.7 37.12,13.54 37.12,20.11 38.1,21.09 R13.2
N$67  (via drill 0.35)
  Top 0.152: R14.2 44.45,23.81 v44.45,26.67
  Bottom 0.152: LINEAR_ACTUATOR_3.1 78.74,60.96 55.27,37.49 54.5,37.49 45.34,28.33 45.34,27.56 v44.45,26.67
N$68  (via drill 0.35)
  Top 0.152: R15.2 49.53,25.08 v49.53,26.67
  Bottom 0.152: v49.53,26.67 50.42,27.56 50.42,30.1 76.2,55.88 77.47,55.88 82.55,60.96 82.55,68.58 81.28,69.85 76.2,69.85 LINEAR_ACTUATOR_3.2
N$69
  Top 0.152: C3.1 30.14,48.87 28.96,48.87 24.6,44.51 IC6.5
N$70
  Bottom 0.152: U$1.10 16.51,62.23 EXTRA_ENCODERS.5
N$71  (via drill 0.35)
  Top 0.152: v19.25,51.46 14.03,51.46 v13.97,51.41
  Bottom 0.152: IC3.3 22.84,48.97 23.23,48.97 23.37,49.11 23.37,51.23 23.23,51.36 19.35,51.36 v19.25,51.46 | v13.97,51.41 12.04,53.34 IC4.1
N$72
  Top 0.152: EXTRA_ENCODERS_2.5 82.3,57.15 U$1.23
N$73
  Top 0.152: EXTRA_ENCODERS_2.4 76.83,53.98 U$1.25
N$74
  Top 0.152: EXTRA_ENCODERS_2.3 79.38,48.89 U$1.27
N$75
  Top 0.152: EXTRA_ENCODERS_2.2 81.91,43.81 U$1.29
N$76
  Top 0.152: EXTRA_ENCODERS_2.1 84.2,38.99 U$1.31
N$77
  Top 0.152: U$1.30 75.32,45.33 75.32,44.08 77.98,41.42 77.98,28.7 79.25,27.43 79.25,16.38 82.93,12.7 LIMIT_SWITCHES.1
N$78
  Top 0.152: U$1.28 75.32,47.87 75.32,46.62 80.26,41.68 80.26,21.72 LIMIT_SWITCHES.2
N$79  (via drill 0.35)
  Top 0.152: U$1.26 75.32,50.41 76.57,50.41 78.72,48.26 v78.74,48.26
  Bottom 0.152: v78.74,48.26 78.74,30.48 84.2,25.02 LIMIT_SWITCHES.3
N$80  (via drill 0.35)
  Top 0.152: U$1.24 74.95,54.61 75.83,53.73 76.58,53.73 v79.76,50.55
  Bottom 0.152: v79.76,50.55 79.76,32.39 LIMIT_SWITCHES.4
N$81  (via drill 0.35)
  Top 0.152: U$1.22 74.95,57.15 75.83,56.27 79.88,56.27 v80.77,55.37
  Bottom 0.152: v80.77,55.37 80.77,36.45 LIMIT_SWITCHES.5
PW1  (via drill 0.35)
  Top 0.152: U$1.7 26.69,59.69 28.57,57.81 32.36,57.81 58.63,31.54 58.63,23.39 59.16,22.86 v59.69,22.86 | v68.58,22.86 69.68,21.76 D7.2
  Bottom 0.152: v59.69,22.86 v68.58,22.86
PWM3
  Top 0.152: U$1.5 31.75,58.42 34.29,58.42 60.96,31.75 60.96,27.45 D9.2
PWM4
  Top 0.152: D10.2 58.42,35.07 58.42,35.56 34.29,59.69 U$1.4
PWM5
  Top 0.152: U$1.3 51.46,43.79 51.46,43.77 58.72,36.51 D11.2
PWM6
  Top 0.152: U$1.2 38.1,58.42 51.77,44.75 51.77,43.89 55.75,39.91 60.66,39.91 60.79,40.05 60.79,40.32 D12.2
PWN2
  Top 0.152: U$1.6 29.23,59.69 30.81,58.12 33.33,58.12 58.93,32.51 58.93,24.79 62.06,21.66 D8.2
RC  (via drill 0.35)
  Top 0.152: v31.88,36.19 31.88,40.94 30.25,42.56 30.25,45.46 30.61,45.82 31.11,45.82 31.45,45.48 v31.99,45.48 | v45.72,51.94 v51.44,51.94 | v49.28,50.55 48.89,50.55 48.64,50.29 48.64,50.17 50.48,48.33 R31.2
  Bottom 0.152: v45.72,51.94 36.37,51.94 34.66,50.24 34.27,50.24 IC1.2 33.96,49.12 34.79,49.12 35.1,48.81 35.1,46.87 34.66,46.43 34.27,46.43 IC1.5 32.23,45.72 v31.99,45.48 | IC2.5 32.84,35 32.44,35 31.88,35.57 v31.88,36.19 31.95,36.27 34.66,36.27 34.8,36.41 34.8,37.25 34.66,37.39 34.27,37.39 IC2.2 | IC5.1 54.48,48.89 v51.44,51.94 50.04,50.55 v49.28,50.55
TX1
  Bottom 0.152: SABERTOOTH.1 18.47,67.31 20.69,69.53 48.58,69.53 50.8,67.31 50.8,66.04 55.88,60.96 57.15,60.96 U$1.18
VCC  (via drill 0.35)
  Top 0.152: R26.2 55.88,55.38 54.9,54.41 54.9,52.92 55.88,51.94 R28.2 54.29,50.48 v54.23,50.42 | v35.56,40.51 35.56,40.77 34.29,42.04 R23.2 | v13.84,49.53 R8.2 18.74,48.89 18.74,47.32 17.14,45.72 IC6.8 15.37,42.73 v15.37,39.75 | v24.51,26.29 16.38,26.29 v16,26.67 | U$1.5V v17.78,12.7 | v24.51,38.86 21.4,38.86 IC6.4 | v8.89,41.28 9.02,41.15 v13.72,41.15 | v41.91,34.29 v41.91,30.48 | v29.21,34.54 v29.21,30.48 | v29.21,28.83 28.32,27.94 JP1.1 | R31.1 50.45,50.23 49.53,51.15 49.02,51.15 48.34,50.46 48.34,49.99 v48.15,49.8
  Bottom 0.152: v24.51,26.29 26.16,27.94 JP1.1 | IC12.14 16,25.43 v16,26.67 | v29.21,30.48 v29.21,28.83 | IC4.14 4.14,54.2 4.14,57.62 4.69,58.17 5.47,58.17 6.02,57.62 6.02,56.08 8.2,53.9 12.34,53.9 14.58,51.66 14.58,51.16 13.84,50.42 v13.84,49.53 | v48.15,49.8 48.52,49.43 IC5.8
  pour Bottom: -5.08,76.2 95.25,76.2 95.25,-3.81 93.98,-5.08 -3.81,-5.08 -6.35,-2.54 -6.35,74.93

### Text on the board
tNames: EXTRA_ENCODERS_2 | IRIS - XII / Arduino Shield / v.3